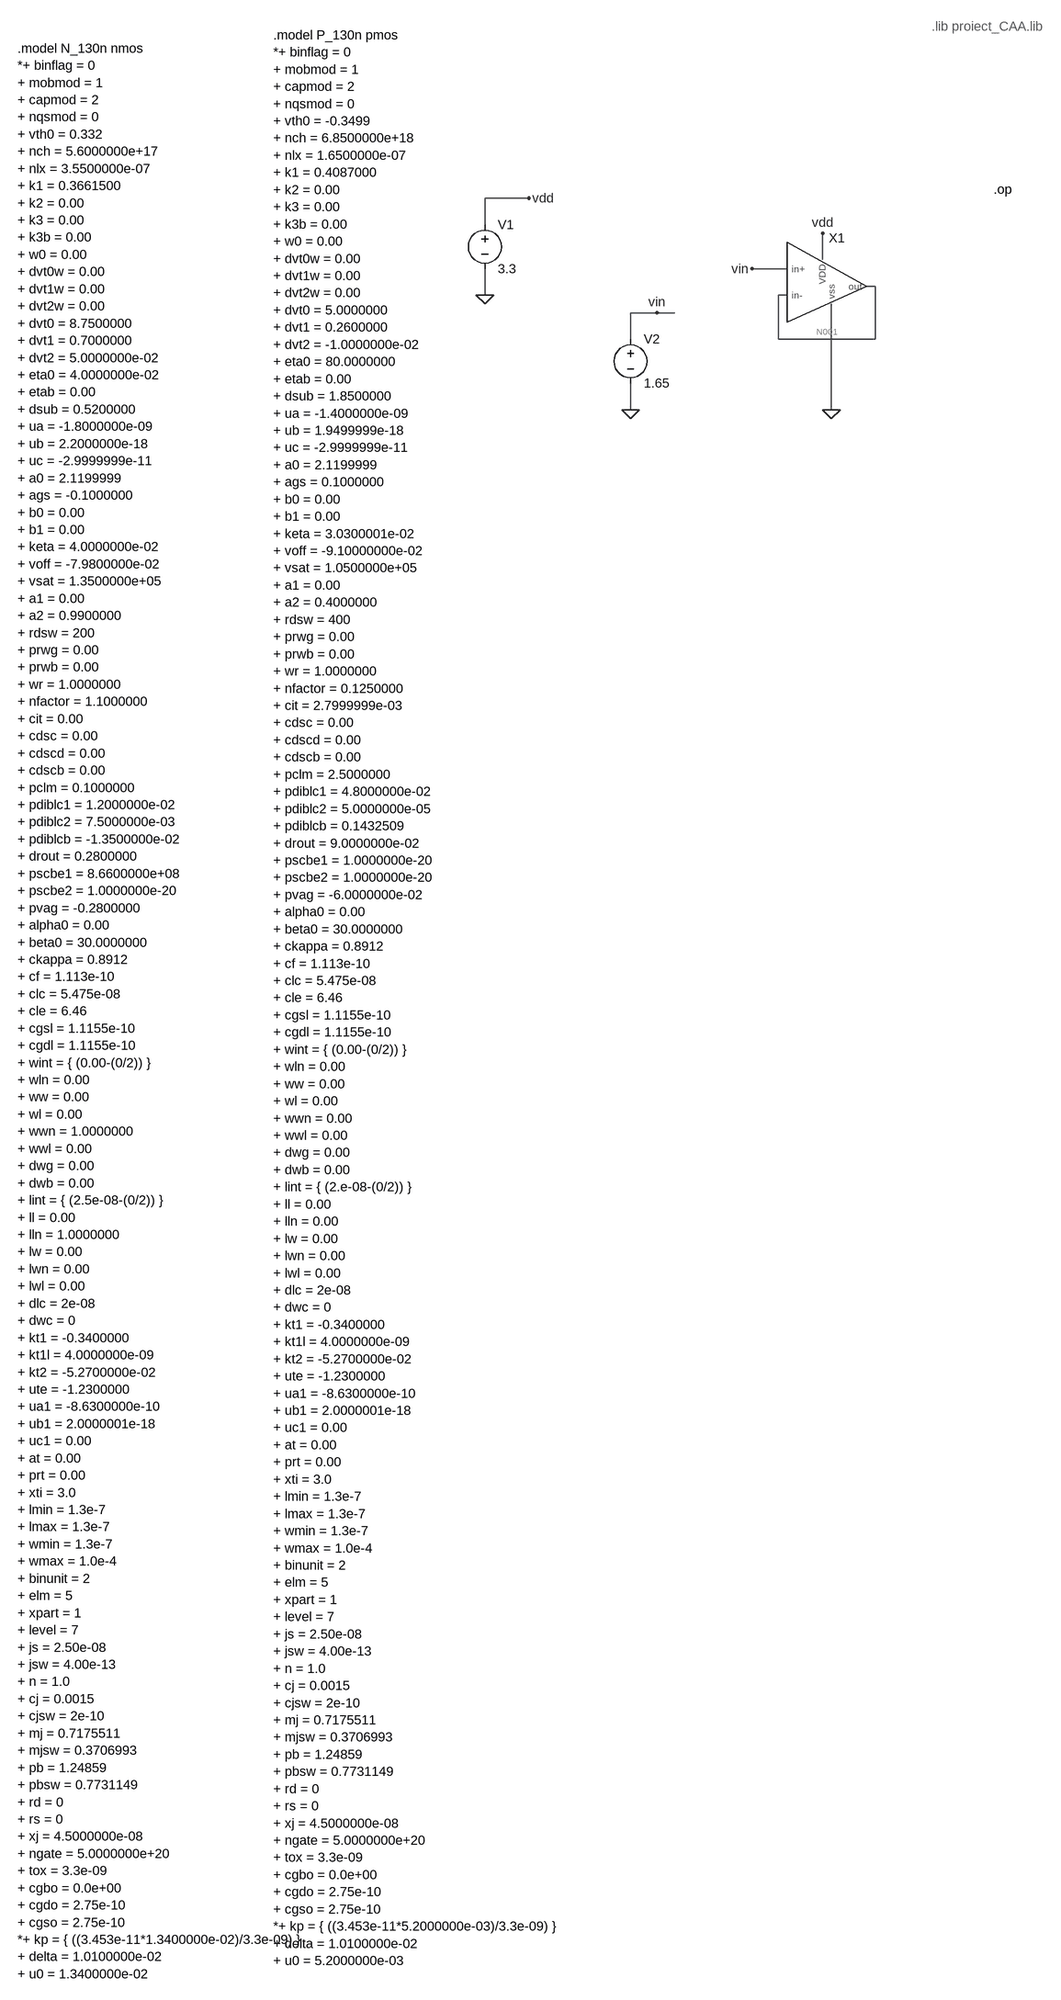
[diagram p0: schematic test_foldedCascode.asc]
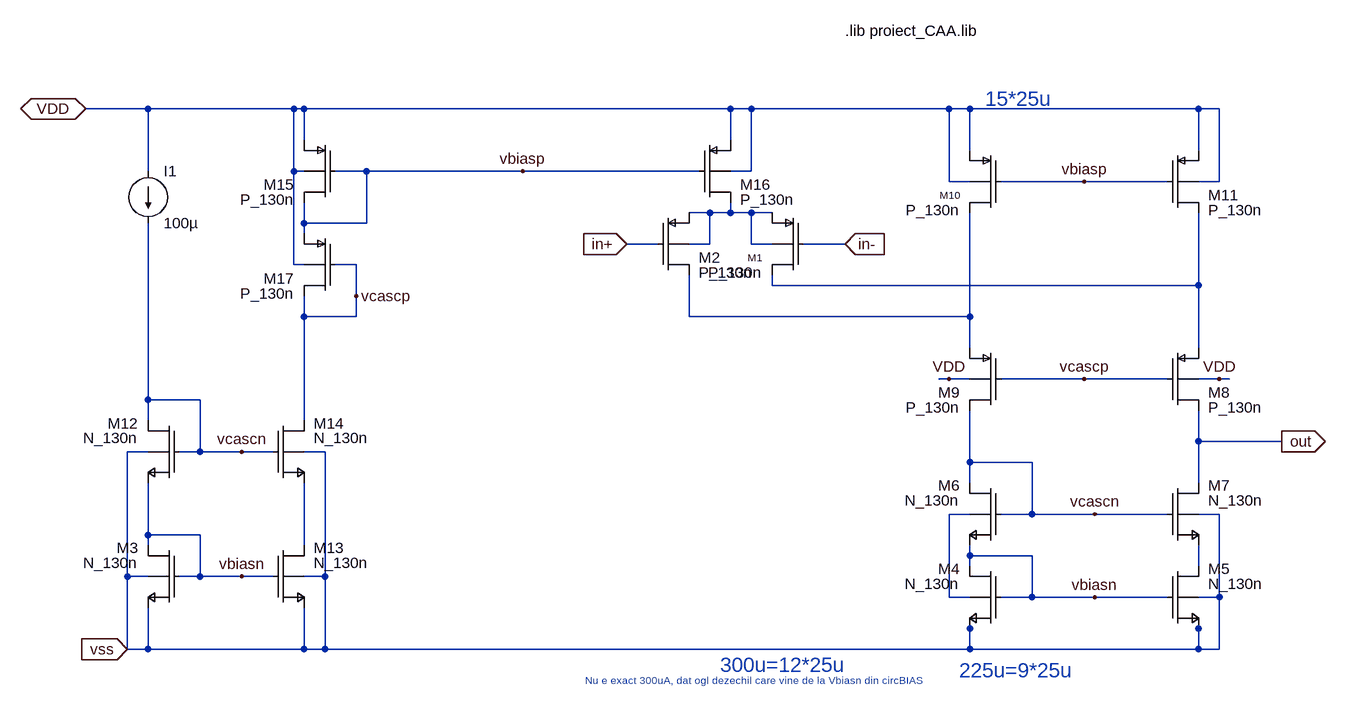
[diagram p1: sub-circuit foldedcascode.asc]
test_foldedCascode.asc, the LTspice schematic file:
Version 4
SHEET 1 1072 2848
WIRE -1792 -32 -1872 -32
WIRE -1872 16 -1872 -32
WIRE -1024 80 -1024 32
WIRE -1088 96 -1152 96
WIRE -928 128 -944 128
WIRE -1872 144 -1872 96
WIRE -1088 144 -1104 144
WIRE -1488 176 -1536 176
WIRE -1456 176 -1488 176
WIRE -1536 224 -1536 176
WIRE -1104 224 -1104 144
WIRE -928 224 -928 128
WIRE -928 224 -1104 224
WIRE -1536 352 -1536 304
WIRE -1008 352 -1008 160
FLAG -1008 352 0
FLAG -1536 352 0
FLAG -1872 144 0
FLAG -1792 -32 vdd
FLAG -1024 32 vdd
FLAG -1488 176 vin
FLAG -1152 96 vin
SYMBOL voltage -1872 0 R0
WINDOW 123 0 0 Left 0
WINDOW 39 0 0 Left 0
SYMATTR InstName V1
SYMATTR Value 3.3
SYMBOL voltage -1536 208 R0
WINDOW 123 0 0 Left 0
WINDOW 39 0 0 Left 0
SYMATTR InstName V2
SYMATTR Value 1.65
SYMBOL foldedCascode -1024 144 R0
SYMATTR InstName X1
TEXT -512 -48 Left 2 !.op
TEXT -624 -344 Left 2 ;.lib proiect_CAA.lib
TEXT -2256 -328 Left 2 !.model P_130n pmos \n*+ binflag = 0 \n+ mobmod = 1 \n+ capmod = 2 \n+ nqsmod = 0 \n+ vth0 = -0.3499 \n+ nch = 6.8500000e+18 \n+ nlx = 1.6500000e-07 \n+ k1 = 0.4087000 \n+ k2 = 0.00 \n+ k3 = 0.00 \n+ k3b = 0.00 \n+ w0 = 0.00 \n+ dvt0w = 0.00 \n+ dvt1w = 0.00 \n+ dvt2w = 0.00 \n+ dvt0 = 5.0000000 \n+ dvt1 = 0.2600000 \n+ dvt2 = -1.0000000e-02 \n+ eta0 = 80.0000000 \n+ etab = 0.00 \n+ dsub = 1.8500000 \n+ ua = -1.4000000e-09 \n+ ub = 1.9499999e-18 \n+ uc = -2.9999999e-11 \n+ a0 = 2.1199999 \n+ ags = 0.1000000 \n+ b0 = 0.00 \n+ b1 = 0.00 \n+ keta = 3.0300001e-02 \n+ voff = -9.10000000e-02 \n+ vsat = 1.0500000e+05 \n+ a1 = 0.00 \n+ a2 = 0.4000000 \n+ rdsw = 400 \n+ prwg = 0.00 \n+ prwb = 0.00 \n+ wr = 1.0000000 \n+ nfactor = 0.1250000 \n+ cit = 2.7999999e-03 \n+ cdsc = 0.00 \n+ cdscd = 0.00 \n+ cdscb = 0.00 \n+ pclm = 2.5000000 \n+ pdiblc1 = 4.8000000e-02 \n+ pdiblc2 = 5.0000000e-05 \n+ pdiblcb = 0.1432509 \n+ drout = 9.0000000e-02 \n+ pscbe1 = 1.0000000e-20 \n+ pscbe2 = 1.0000000e-20 \n+ pvag = -6.0000000e-02 \n+ alpha0 = 0.00 \n+ beta0 = 30.0000000 \n+ ckappa = 0.8912 \n+ cf = 1.113e-10 \n+ clc = 5.475e-08 \n+ cle = 6.46 \n+ cgsl = 1.1155e-10 \n+ cgdl = 1.1155e-10 \n+ wint = { (0.00-(0/2)) } \n+ wln = 0.00 \n+ ww = 0.00 \n+ wl = 0.00 \n+ wwn = 0.00 \n+ wwl = 0.00 \n+ dwg = 0.00 \n+ dwb = 0.00 \n+ lint = { (2.e-08-(0/2)) } \n+ ll = 0.00 \n+ lln = 0.00 \n+ lw = 0.00 \n+ lwn = 0.00 \n+ lwl = 0.00 \n+ dlc = 2e-08 \n+ dwc = 0 \n+ kt1 = -0.3400000 \n+ kt1l = 4.0000000e-09 \n+ kt2 = -5.2700000e-02 \n+ ute = -1.2300000 \n+ ua1 = -8.6300000e-10 \n+ ub1 = 2.0000001e-18 \n+ uc1 = 0.00 \n+ at = 0.00 \n+ prt = 0.00 \n+ xti = 3.0 \n+ lmin = 1.3e-7 \n+ lmax = 1.3e-7 \n+ wmin = 1.3e-7 \n+ wmax = 1.0e-4 \n+ binunit = 2 \n+ elm = 5 \n+ xpart = 1 \n+ level = 7 \n+ js = 2.50e-08 \n+ jsw = 4.00e-13 \n+ n = 1.0 \n+ cj = 0.0015 \n+ cjsw = 2e-10 \n+ mj = 0.7175511 \n+ mjsw = 0.3706993 \n+ pb = 1.24859 \n+ pbsw = 0.7731149 \n+ rd = 0 \n+ rs = 0 \n+ xj = 4.5000000e-08 \n+ ngate = 5.0000000e+20 \n+ tox = 3.3e-09 \n+ cgbo = 0.0e+00 \n+ cgdo = 2.75e-10 \n+ cgso = 2.75e-10 \n*+ kp = { ((3.453e-11*5.2000000e-03)/3.3e-09) } \n+ delta = 1.0100000e-02 \n+ u0 = 5.2000000e-03
TEXT -2720 -304 Left 2 !.model N_130n nmos \n*+ binflag = 0 \n+ mobmod = 1 \n+ capmod = 2 \n+ nqsmod = 0 \n+ vth0 = 0.332 \n+ nch = 5.6000000e+17 \n+ nlx = 3.5500000e-07 \n+ k1 = 0.3661500 \n+ k2 = 0.00 \n+ k3 = 0.00 \n+ k3b = 0.00 \n+ w0 = 0.00 \n+ dvt0w = 0.00 \n+ dvt1w = 0.00 \n+ dvt2w = 0.00 \n+ dvt0 = 8.7500000 \n+ dvt1 = 0.7000000 \n+ dvt2 = 5.0000000e-02 \n+ eta0 = 4.0000000e-02 \n+ etab = 0.00 \n+ dsub = 0.5200000 \n+ ua = -1.8000000e-09 \n+ ub = 2.2000000e-18 \n+ uc = -2.9999999e-11 \n+ a0 = 2.1199999 \n+ ags = -0.1000000 \n+ b0 = 0.00 \n+ b1 = 0.00 \n+ keta = 4.0000000e-02 \n+ voff = -7.9800000e-02 \n+ vsat = 1.3500000e+05 \n+ a1 = 0.00 \n+ a2 = 0.9900000 \n+ rdsw = 200 \n+ prwg = 0.00 \n+ prwb = 0.00 \n+ wr = 1.0000000 \n+ nfactor = 1.1000000 \n+ cit = 0.00 \n+ cdsc = 0.00 \n+ cdscd = 0.00 \n+ cdscb = 0.00 \n+ pclm = 0.1000000 \n+ pdiblc1 = 1.2000000e-02 \n+ pdiblc2 = 7.5000000e-03 \n+ pdiblcb = -1.3500000e-02 \n+ drout = 0.2800000 \n+ pscbe1 = 8.6600000e+08 \n+ pscbe2 = 1.0000000e-20 \n+ pvag = -0.2800000 \n+ alpha0 = 0.00 \n+ beta0 = 30.0000000 \n+ ckappa = 0.8912 \n+ cf = 1.113e-10 \n+ clc = 5.475e-08 \n+ cle = 6.46 \n+ cgsl = 1.1155e-10 \n+ cgdl = 1.1155e-10 \n+ wint = { (0.00-(0/2)) } \n+ wln = 0.00 \n+ ww = 0.00 \n+ wl = 0.00 \n+ wwn = 1.0000000 \n+ wwl = 0.00 \n+ dwg = 0.00 \n+ dwb = 0.00 \n+ lint = { (2.5e-08-(0/2)) } \n+ ll = 0.00 \n+ lln = 1.0000000 \n+ lw = 0.00 \n+ lwn = 0.00 \n+ lwl = 0.00 \n+ dlc = 2e-08 \n+ dwc = 0 \n+ kt1 = -0.3400000 \n+ kt1l = 4.0000000e-09 \n+ kt2 = -5.2700000e-02 \n+ ute = -1.2300000 \n+ ua1 = -8.6300000e-10 \n+ ub1 = 2.0000001e-18 \n+ uc1 = 0.00 \n+ at = 0.00 \n+ prt = 0.00 \n+ xti = 3.0 \n+ lmin = 1.3e-7 \n+ lmax = 1.3e-7 \n+ wmin = 1.3e-7 \n+ wmax = 1.0e-4 \n+ binunit = 2 \n+ elm = 5\n+ xpart = 1 \n+ level = 7 \n+ js = 2.50e-08 \n+ jsw = 4.00e-13 \n+ n = 1.0 \n+ cj = 0.0015 \n+ cjsw = 2e-10 \n+ mj = 0.7175511 \n+ mjsw = 0.3706993 \n+ pb = 1.24859 \n+ pbsw = 0.7731149 \n+ rd = 0 \n+ rs = 0 \n+ xj = 4.5000000e-08 \n+ ngate = 5.0000000e+20 \n+ tox = 3.3e-09 \n+ cgbo = 0.0e+00 \n+ cgdo = 2.75e-10 \n+ cgso = 2.75e-10 \n*+ kp = { ((3.453e-11*1.3400000e-02)/3.3e-09) } \n+ delta = 1.0100000e-02 \n+ u0 = 1.3400000e-02

foldedcascode.asc, the sub-circuit schematic file:
Version 4
SHEET 1 1072 700
WIRE -1696 -224 -1792 -224
WIRE -1472 -224 -1696 -224
WIRE -1456 -224 -1472 -224
WIRE -800 -224 -1456 -224
WIRE -768 -224 -800 -224
WIRE -464 -224 -768 -224
WIRE -432 -224 -464 -224
WIRE -80 -224 -432 -224
WIRE -48 -224 -80 -224
WIRE -1456 -176 -1456 -224
WIRE -800 -176 -800 -224
WIRE -432 -160 -432 -224
WIRE -80 -160 -80 -224
WIRE -1696 -128 -1696 -224
WIRE -1472 -128 -1472 -224
WIRE -1456 -128 -1472 -128
WIRE -1360 -128 -1408 -128
WIRE -1120 -128 -1360 -128
WIRE -848 -128 -1120 -128
WIRE -768 -128 -768 -224
WIRE -768 -128 -800 -128
WIRE -464 -112 -464 -224
WIRE -432 -112 -464 -112
WIRE -256 -112 -384 -112
WIRE -128 -112 -256 -112
WIRE -48 -112 -48 -224
WIRE -48 -112 -80 -112
WIRE -832 -64 -864 -64
WIRE -800 -64 -800 -80
WIRE -800 -64 -832 -64
WIRE -768 -64 -800 -64
WIRE -736 -64 -768 -64
WIRE -1456 -48 -1456 -80
WIRE -1360 -48 -1360 -128
WIRE -1360 -48 -1456 -48
WIRE -1456 -32 -1456 -48
WIRE -912 -16 -960 -16
WIRE -832 -16 -832 -64
WIRE -832 -16 -864 -16
WIRE -768 -16 -768 -64
WIRE -736 -16 -768 -16
WIRE -624 -16 -688 -16
WIRE -1472 16 -1472 -128
WIRE -1456 16 -1472 16
WIRE -1376 16 -1408 16
WIRE -736 48 -736 32
WIRE -80 48 -80 -64
WIRE -80 48 -736 48
WIRE -1376 64 -1376 16
WIRE -1456 96 -1456 64
WIRE -1376 96 -1376 64
WIRE -1376 96 -1456 96
WIRE -864 96 -864 32
WIRE -432 96 -432 -64
WIRE -432 96 -864 96
WIRE -432 144 -432 96
WIRE -80 144 -80 48
WIRE -464 192 -480 192
WIRE -432 192 -464 192
WIRE -256 192 -384 192
WIRE -128 192 -256 192
WIRE -48 192 -80 192
WIRE -32 192 -48 192
WIRE -1696 224 -1696 -48
WIRE -1616 224 -1696 224
WIRE -1696 256 -1696 224
WIRE -1456 256 -1456 96
WIRE -80 288 -80 240
WIRE 48 288 -80 288
WIRE -1696 304 -1728 304
WIRE -1616 304 -1616 224
WIRE -1616 304 -1648 304
WIRE -1552 304 -1616 304
WIRE -1504 304 -1552 304
WIRE -1424 304 -1456 304
WIRE -432 320 -432 240
WIRE -336 320 -432 320
WIRE -432 352 -432 320
WIRE -80 352 -80 288
WIRE -432 400 -464 400
WIRE -336 400 -336 320
WIRE -336 400 -384 400
WIRE -240 400 -336 400
WIRE -128 400 -240 400
WIRE -48 400 -80 400
WIRE -1696 432 -1696 352
WIRE -1616 432 -1696 432
WIRE -1696 448 -1696 432
WIRE -1456 448 -1456 352
WIRE -432 464 -432 448
WIRE -336 464 -432 464
WIRE -432 480 -432 464
WIRE -80 480 -80 448
WIRE -1728 496 -1728 304
WIRE -1696 496 -1728 496
WIRE -1616 496 -1616 432
WIRE -1616 496 -1648 496
WIRE -1552 496 -1616 496
WIRE -1504 496 -1552 496
WIRE -1424 496 -1424 304
WIRE -1424 496 -1456 496
WIRE -464 528 -464 400
WIRE -432 528 -464 528
WIRE -336 528 -336 464
WIRE -336 528 -384 528
WIRE -240 528 -336 528
WIRE -128 528 -240 528
WIRE -48 528 -48 400
WIRE -48 528 -80 528
WIRE -432 576 -432 560
WIRE -80 576 -80 560
WIRE -1728 608 -1728 496
WIRE -1696 608 -1696 544
WIRE -1696 608 -1728 608
WIRE -1456 608 -1456 544
WIRE -1456 608 -1696 608
WIRE -1424 608 -1424 496
WIRE -1424 608 -1456 608
WIRE -432 608 -432 576
WIRE -432 608 -1424 608
WIRE -80 608 -80 576
WIRE -80 608 -432 608
WIRE -48 608 -48 528
WIRE -48 608 -80 608
FLAG -1792 -224 VDD
IOPIN -1792 -224 BiDir
FLAG -464 192 VDD
FLAG -48 192 VDD
FLAG -256 -112 vbiasp
FLAG -1120 -128 vbiasp
FLAG -960 -16 in+
IOPIN -960 -16 In
FLAG -624 -16 in-
IOPIN -624 -16 In
FLAG -1552 304 vcascn
FLAG -1552 496 vbiasn
FLAG -240 400 vcascn
FLAG -240 528 vbiasn
FLAG -1376 64 vcascp
FLAG -256 192 vcascp
FLAG 48 288 out
IOPIN 48 288 Out
FLAG -1728 608 vss
IOPIN -1728 608 In
DATAFLAG -512 48 ""
DATAFLAG -464 96 ""
DATAFLAG 0 288 ""
SYMBOL nmosb -384 480 M0
WINDOW 0 63 4 Left 2
SYMATTR InstName M4
SYMATTR Value N_130n
SYMATTR Value2 l=2.0u w=4.0u ad=800.0f as=800.0f pd=8.4u ps=8.4u m=1
SYMBOL nmosb -128 480 R0
WINDOW 0 63 4 Left 2
SYMATTR InstName M5
SYMATTR Value N_130n
SYMATTR Value2 l=2.0u w=4.0u ad=800.0f as=800.0f pd=8.4u ps=8.4u m=1
SYMBOL nmosb -384 352 M0
WINDOW 0 63 4 Left 2
SYMATTR InstName M6
SYMATTR Value N_130n
SYMATTR Value2 l=2.0u w=4.0u ad=800.0f as=800.0f pd=8.4u ps=8.4u m=1
SYMBOL nmosb -128 352 R0
WINDOW 0 63 4 Left 2
SYMATTR InstName M7
SYMATTR Value N_130n
SYMATTR Value2 l=2.0u w=4.0u ad=800.0f as=800.0f pd=8.4u ps=8.4u m=1
SYMBOL pmosb -128 144 R0
WINDOW 0 63 69 Left 2
SYMATTR InstName M8
SYMATTR Value P_130n
SYMATTR Value2 l=2.0u w=4.0u ad=800.0f as=800.0f pd=8.4u ps=8.4u m=1
SYMBOL pmosb -384 144 M0
WINDOW 0 63 69 Left 2
SYMATTR InstName M9
SYMATTR Value P_130n
SYMATTR Value2 l=2.0u w=4.0u ad=800.0f as=800.0f pd=8.4u ps=8.4u m=1
SYMBOL pmosb -384 -160 M0
WINDOW 0 63 69 Left 1
SYMATTR InstName M10
SYMATTR Value P_130n
SYMATTR Value2 l=2.0u w=4.0u ad=800.0f as=800.0f pd=8.4u ps=8.4u m=1
SYMBOL pmosb -128 -160 R0
WINDOW 0 63 69 Left 2
SYMATTR InstName M11
SYMATTR Value P_130n
SYMATTR Value2 l=1u w=14u ad=2.8p as=2.8p pd=28.4u ps=28.4u m=15
SYMBOL pmosb -688 -64 M0
WINDOW 0 63 69 Left 1
SYMATTR InstName M1
SYMATTR Value P_130n
SYMATTR Value2 l=1u w=14u ad=2.8p as=2.8p pd=28.4u ps=28.4u m=15
SYMBOL pmosb -912 -64 R0
WINDOW 0 63 69 Left 2
SYMATTR InstName M2
SYMATTR Value P_130n
SYMATTR Value2 l=1u w=14u ad=2.8p as=2.8p pd=28.4u ps=28.4u m=15
SYMBOL current -1696 -128 R0
WINDOW 123 0 0 Left 0
WINDOW 39 0 0 Left 0
SYMATTR InstName I1
SYMATTR Value 100µ
SYMBOL nmosb -1648 448 M0
WINDOW 0 63 4 Left 2
SYMATTR InstName M3
SYMATTR Value N_130n
SYMATTR Value2 l=2.0u w=4.0u ad=800.0f as=800.0f pd=8.4u ps=8.4u m=1
SYMBOL nmosb -1648 256 M0
WINDOW 0 63 4 Left 2
SYMATTR InstName M12
SYMATTR Value N_130n
SYMATTR Value2 l=2.0u w=4.0u ad=800.0f as=800.0f pd=8.4u ps=8.4u m=1
SYMBOL nmosb -1504 448 R0
WINDOW 0 63 4 Left 2
SYMATTR InstName M13
SYMATTR Value N_130n
SYMATTR Value2 l=2.0u w=4.0u ad=800.0f as=800.0f pd=8.4u ps=8.4u m=1
SYMBOL nmosb -1504 256 R0
WINDOW 0 63 4 Left 2
SYMATTR InstName M14
SYMATTR Value N_130n
SYMATTR Value2 l=2.0u w=4.0u ad=800.0f as=800.0f pd=8.4u ps=8.4u m=1
SYMBOL pmosb -1408 -176 M0
WINDOW 0 63 69 Left 2
SYMATTR InstName M15
SYMATTR Value P_130n
SYMATTR Value2 l=2.0u w=4.0u ad=800.0f as=800.0f pd=8.4u ps=8.4u m=1
SYMBOL pmosb -848 -176 R0
WINDOW 0 63 69 Left 2
SYMATTR InstName M16
SYMATTR Value P_130n
SYMATTR Value2 l=2.0u w=4.0u ad=800.0f as=800.0f pd=8.4u ps=8.4u m=1
SYMBOL pmosb -1408 -32 M0
WINDOW 0 63 69 Left 2
SYMATTR InstName M17
SYMATTR Value P_130n
SYMATTR Value2 l=2.0u w=4.0u ad=800.0f as=800.0f pd=8.4u ps=8.4u m=1
TEXT -448 640 Left 3 ;225u=9*25u
TEXT -816 632 Left 3 ;300u=12*25u
TEXT -1024 656 Left 1 ;Nu e exact 300uA, dat ogl dezechil care vine de la Vbiasn din circBIAS
TEXT -408 -240 Left 3 ;15*25u
TEXT -624 -344 Left 2 !.lib proiect_CAA.lib

The netlist it stands for:
* test_foldedCascode.asc
V1 vdd 0 3.3
V2 vin 0 1.65
XX1 vin N001 0 N001 vdd foldedcascode

* block symbol definitions
.subckt foldedcascode in+ in- vss out VDD
M4 vbiasn vbiasn vss N004 N_130n l=2.0u w=4.0u ad=800.0f as=800.0f pd=8.4u ps=8.4u m=1
M5 N006 vbiasn vss vss N_130n l=2.0u w=4.0u ad=800.0f as=800.0f pd=8.4u ps=8.4u m=1
M6 vcascn vcascn vbiasn N004 N_130n l=2.0u w=4.0u ad=800.0f as=800.0f pd=8.4u ps=8.4u m=1
M7 out vcascn N006 vss N_130n l=2.0u w=4.0u ad=800.0f as=800.0f pd=8.4u ps=8.4u m=1
M8 out vcascp N002 VDD P_130n l=2.0u w=4.0u ad=800.0f as=800.0f pd=8.4u ps=8.4u m=1
M9 vcascn vcascp N003 VDD P_130n l=2.0u w=4.0u ad=800.0f as=800.0f pd=8.4u ps=8.4u m=1
M10 N003 vbiasp VDD VDD P_130n l=2.0u w=4.0u ad=800.0f as=800.0f pd=8.4u ps=8.4u m=1
M11 N002 vbiasp VDD VDD P_130n l=1u w=14u ad=2.8p as=2.8p pd=28.4u ps=28.4u m=15
M1 N002 in- N001 N001 P_130n l=1u w=14u ad=2.8p as=2.8p pd=28.4u ps=28.4u m=15
M2 N003 in+ N001 N001 P_130n l=1u w=14u ad=2.8p as=2.8p pd=28.4u ps=28.4u m=15
I1 VDD vcascn 100µ
M3 vbiasn vbiasn vss vss N_130n l=2.0u w=4.0u ad=800.0f as=800.0f pd=8.4u ps=8.4u m=1
M12 vcascn vcascn vbiasn vss N_130n l=2.0u w=4.0u ad=800.0f as=800.0f pd=8.4u ps=8.4u m=1
M13 N005 vbiasn vss vss N_130n l=2.0u w=4.0u ad=800.0f as=800.0f pd=8.4u ps=8.4u m=1
M14 vcascp vcascn N005 vss N_130n l=2.0u w=4.0u ad=800.0f as=800.0f pd=8.4u ps=8.4u m=1
M15 vbiasp vbiasp VDD VDD P_130n l=2.0u w=4.0u ad=800.0f as=800.0f pd=8.4u ps=8.4u m=1
M16 N001 vbiasp VDD VDD P_130n l=2.0u w=4.0u ad=800.0f as=800.0f pd=8.4u ps=8.4u m=1
M17 vcascp vcascp vbiasp VDD P_130n l=2.0u w=4.0u ad=800.0f as=800.0f pd=8.4u ps=8.4u m=1
* 225u=9*25u
* 300u=12*25u
* Nu e exact 300uA, dat ogl dezechil care vine de la Vbiasn din circBIAS
* 15*25u
.lib proiect_CAA.lib
.ends foldedcascode

.model NMOS NMOS
.model PMOS PMOS
.lib standard.mos
.op
* .lib proiect_CAA.lib
.model P_130n pmos
*+ binflag = 0
+ mobmod = 1
+ capmod = 2
+ nqsmod = 0
+ vth0 = -0.3499
+ nch = 6.8500000e+18
+ nlx = 1.6500000e-07
+ k1 = 0.4087000
+ k2 = 0.00
+ k3 = 0.00
+ k3b = 0.00
+ w0 = 0.00
+ dvt0w = 0.00
+ dvt1w = 0.00
+ dvt2w = 0.00
+ dvt0 = 5.0000000
+ dvt1 = 0.2600000
+ dvt2 = -1.0000000e-02
+ eta0 = 80.0000000
+ etab = 0.00
+ dsub = 1.8500000
+ ua = -1.4000000e-09
+ ub = 1.9499999e-18
+ uc = -2.9999999e-11
+ a0 = 2.1199999
+ ags = 0.1000000
+ b0 = 0.00
+ b1 = 0.00
+ keta = 3.0300001e-02
+ voff = -9.10000000e-02
+ vsat = 1.0500000e+05
+ a1 = 0.00
+ a2 = 0.4000000
+ rdsw = 400
+ prwg = 0.00
+ prwb = 0.00
+ wr = 1.0000000
+ nfactor = 0.1250000
+ cit = 2.7999999e-03
+ cdsc = 0.00
+ cdscd = 0.00
+ cdscb = 0.00
+ pclm = 2.5000000
+ pdiblc1 = 4.8000000e-02
+ pdiblc2 = 5.0000000e-05
+ pdiblcb = 0.1432509
+ drout = 9.0000000e-02
+ pscbe1 = 1.0000000e-20
+ pscbe2 = 1.0000000e-20
+ pvag = -6.0000000e-02
+ alpha0 = 0.00
+ beta0 = 30.0000000
+ ckappa = 0.8912
+ cf = 1.113e-10
+ clc = 5.475e-08
+ cle = 6.46
+ cgsl = 1.1155e-10
+ cgdl = 1.1155e-10
+ wint = { (0.00-(0/2)) }
+ wln = 0.00
+ ww = 0.00
+ wl = 0.00
+ wwn = 0.00
+ wwl = 0.00
+ dwg = 0.00
+ dwb = 0.00
+ lint = { (2.e-08-(0/2)) }
+ ll = 0.00
+ lln = 0.00
+ lw = 0.00
+ lwn = 0.00
+ lwl = 0.00
+ dlc = 2e-08
+ dwc = 0
+ kt1 = -0.3400000
+ kt1l = 4.0000000e-09
+ kt2 = -5.2700000e-02
+ ute = -1.2300000
+ ua1 = -8.6300000e-10
+ ub1 = 2.0000001e-18
+ uc1 = 0.00
+ at = 0.00
+ prt = 0.00
+ xti = 3.0
+ lmin = 1.3e-7
+ lmax = 1.3e-7
+ wmin = 1.3e-7
+ wmax = 1.0e-4
+ binunit = 2
+ elm = 5
+ xpart = 1
+ level = 7
+ js = 2.50e-08
+ jsw = 4.00e-13
+ n = 1.0
+ cj = 0.0015
+ cjsw = 2e-10
+ mj = 0.7175511
+ mjsw = 0.3706993
+ pb = 1.24859
+ pbsw = 0.7731149
+ rd = 0
+ rs = 0
+ xj = 4.5000000e-08
+ ngate = 5.0000000e+20
+ tox = 3.3e-09
+ cgbo = 0.0e+00
+ cgdo = 2.75e-10
+ cgso = 2.75e-10
*+ kp = { ((3.453e-11*5.2000000e-03)/3.3e-09) }
+ delta = 1.0100000e-02
+ u0 = 5.2000000e-03
.model N_130n nmos
*+ binflag = 0
+ mobmod = 1
+ capmod = 2
+ nqsmod = 0
+ vth0 = 0.332
+ nch = 5.6000000e+17
+ nlx = 3.5500000e-07
+ k1 = 0.3661500
+ k2 = 0.00
+ k3 = 0.00
+ k3b = 0.00
+ w0 = 0.00
+ dvt0w = 0.00
+ dvt1w = 0.00
+ dvt2w = 0.00
+ dvt0 = 8.7500000
+ dvt1 = 0.7000000
+ dvt2 = 5.0000000e-02
+ eta0 = 4.0000000e-02
+ etab = 0.00
+ dsub = 0.5200000
+ ua = -1.8000000e-09
+ ub = 2.2000000e-18
+ uc = -2.9999999e-11
+ a0 = 2.1199999
+ ags = -0.1000000
+ b0 = 0.00
+ b1 = 0.00
+ keta = 4.0000000e-02
+ voff = -7.9800000e-02
+ vsat = 1.3500000e+05
+ a1 = 0.00
+ a2 = 0.9900000
+ rdsw = 200
+ prwg = 0.00
+ prwb = 0.00
+ wr = 1.0000000
+ nfactor = 1.1000000
+ cit = 0.00
+ cdsc = 0.00
+ cdscd = 0.00
+ cdscb = 0.00
+ pclm = 0.1000000
+ pdiblc1 = 1.2000000e-02
+ pdiblc2 = 7.5000000e-03
+ pdiblcb = -1.3500000e-02
+ drout = 0.2800000
+ pscbe1 = 8.6600000e+08
+ pscbe2 = 1.0000000e-20
+ pvag = -0.2800000
+ alpha0 = 0.00
+ beta0 = 30.0000000
+ ckappa = 0.8912
+ cf = 1.113e-10
+ clc = 5.475e-08
+ cle = 6.46
+ cgsl = 1.1155e-10
+ cgdl = 1.1155e-10
+ wint = { (0.00-(0/2)) }
+ wln = 0.00
+ ww = 0.00
+ wl = 0.00
+ wwn = 1.0000000
+ wwl = 0.00
+ dwg = 0.00
+ dwb = 0.00
+ lint = { (2.5e-08-(0/2)) }
+ ll = 0.00
+ lln = 1.0000000
+ lw = 0.00
+ lwn = 0.00
+ lwl = 0.00
+ dlc = 2e-08
+ dwc = 0
+ kt1 = -0.3400000
+ kt1l = 4.0000000e-09
+ kt2 = -5.2700000e-02
+ ute = -1.2300000
+ ua1 = -8.6300000e-10
+ ub1 = 2.0000001e-18
+ uc1 = 0.00
+ at = 0.00
+ prt = 0.00
+ xti = 3.0
+ lmin = 1.3e-7
+ lmax = 1.3e-7
+ wmin = 1.3e-7
+ wmax = 1.0e-4
+ binunit = 2
+ elm = 5
+ xpart = 1
+ level = 7
+ js = 2.50e-08
+ jsw = 4.00e-13
+ n = 1.0
+ cj = 0.0015
+ cjsw = 2e-10
+ mj = 0.7175511
+ mjsw = 0.3706993
+ pb = 1.24859
+ pbsw = 0.7731149
+ rd = 0
+ rs = 0
+ xj = 4.5000000e-08
+ ngate = 5.0000000e+20
+ tox = 3.3e-09
+ cgbo = 0.0e+00
+ cgdo = 2.75e-10
+ cgso = 2.75e-10
*+ kp = { ((3.453e-11*1.3400000e-02)/3.3e-09) }
+ delta = 1.0100000e-02
+ u0 = 1.3400000e-02
.backanno
.end

* Results of the author's LTspice run, read from the files saved beside the schematic
* Operating Point:
*   V(vdd) = 3.3 V
*   V(vin) = 1.65 V
*   V(n001) = 1.53 V
*   I(V1) = -498.7 µA
*   I(V2) = 0 A
*   Ix(x1:IN+) = 0 A
*   Ix(x1:IN-) = 0 A
*   Ix(x1:VSS) = -498.7 µA
*   Ix(x1:OUT) = -10.96 pA
*   Ix(x1:VDD) = 498.7 µA
* From the log:
*   Semiconductor Device Operating Points:
*                           --- BSIM3 MOSFETS ---
*   Name:      m:x1:4      m:x1:5      m:x1:6      m:x1:7      m:x1:3
*   Model:     n_130n      n_130n      n_130n      n_130n      n_130n
*   Id:        1.74e-04    1.74e-04    1.74e-04    1.74e-04    1.00e-04
*   Vgs:       1.46e+00    1.46e+00    1.69e+00    1.67e+00    1.15e+00
*   Vds:       7.98e-01    8.20e-01    6.58e-01    7.10e-01    1.15e+00
*   Vbs:       0.00e+00    0.00e+00   -7.98e-01   -8.20e-01    0.00e+00
*   Vth:       3.62e-01    3.62e-01    4.92e-01    4.95e-01    3.62e-01
*   Vdsat:     7.69e-01    7.69e-01    8.84e-01    8.68e-01    5.71e-01
*   Gm:        2.41e-04    2.44e-04    1.49e-04    1.67e-04    2.29e-04
*   Gds:       2.03e-05    1.62e-05    1.10e-04    7.99e-05    1.51e-06
*   Gmb        4.88e-05    4.90e-05    4.27e-05    4.45e-05    3.81e-05
*   Cbd:       2.13e-15    2.12e-15    1.82e-15    1.80e-15    1.95e-15
*   Cbs:       2.88e-15    2.88e-15    2.13e-15    2.12e-15    2.88e-15
*   Cgsov:     1.99e-15    1.99e-15    1.99e-15    1.99e-15    1.99e-15
*   Cgdov:     1.99e-15    1.99e-15    1.99e-15    1.99e-15    1.95e-15
*   Cgbov:     0.00e+00    0.00e+00    0.00e+00    0.00e+00    0.00e+00
*   dQgdVgb:   6.92e-14    6.86e-14    7.67e-14    7.45e-14    6.58e-14
*   dQgdVdb:  -7.15e-15   -6.31e-15   -2.06e-14   -1.68e-14   -2.04e-15
*   dQgdVsb:  -6.09e-14   -6.11e-14   -5.51e-14   -5.64e-14   -6.16e-14
*   dQddVgb:  -9.87e-15   -8.68e-15   -2.68e-14   -2.23e-14   -2.16e-15
*   dQddVdb:   1.49e-14    1.31e-14    4.09e-14    3.31e-14    4.09e-15
*   dQddVsb:  -2.19e-15   -1.74e-15   -9.26e-15   -6.57e-15    4.86e-17
*   dQbdVgb:  -6.28e-15   -6.50e-15   -2.62e-15   -3.34e-15   -7.81e-15
*   dQbdVdb:  -4.15e-15   -3.81e-15   -7.88e-15   -6.58e-15   -1.99e-15
*   dQbdVsb:  -6.77e-15   -6.84e-15   -4.10e-15   -4.49e-15   -7.79e-15
*   Name:      m:x1:12     m:x1:13     m:x1:14     m:x1:8      m:x1:9
*   Model:     n_130n      n_130n      n_130n      p_130n      p_130n
*   Id:        1.00e-04    5.12e-05    5.12e-05   -1.74e-04   -1.74e-04
*   Vgs:       1.34e+00    1.15e+00    2.31e+00   -2.99e+00   -2.97e+00
*   Vds:       1.34e+00    1.80e-01    1.01e-01   -1.75e+00   -1.80e+00
*   Vbs:      -1.15e+00    0.00e+00   -1.80e-01    2.49e-02    4.51e-02
*   Vth:       5.39e-01    3.62e-01    3.95e-01   -3.72e-01   -3.76e-01
*   Vdsat:     6.18e-01    5.71e-01    1.31e+00   -1.92e+00   -1.90e+00
*   Gm:        2.03e-04    7.15e-05    7.11e-07    3.78e-05    4.18e-05
*   Gds:       1.39e-06    2.30e-04    4.87e-04    2.24e-05    1.73e-05
*   Gmb        3.54e-05    1.56e-05    1.06e-05    3.31e-05    3.32e-05
*   Cbd:       1.53e-15    2.64e-15    2.53e-15    1.72e-15    1.69e-15
*   Cbs:       1.95e-15    2.88e-15    2.64e-15    2.84e-15    2.81e-15
*   Cgsov:     1.99e-15    1.99e-15    1.99e-15    1.99e-15    1.99e-15
*   Cgdov:     1.95e-15    1.99e-15    1.99e-15    1.99e-15    1.99e-15
*   Cgbov:     0.00e+00    0.00e+00    0.00e+00    0.00e+00    0.00e+00
*   dQgdVgb:   6.44e-14    8.40e-14    8.38e-14    6.87e-14    6.76e-14
*   dQgdVdb:  -2.00e-15   -3.51e-14   -4.13e-14   -8.29e-15   -6.60e-15
*   dQgdVsb:  -5.98e-14   -4.85e-14   -4.24e-14   -6.16e-14   -6.21e-14
*   dQddVgb:  -2.08e-15   -4.00e-14   -4.17e-14   -1.10e-14   -8.72e-15
*   dQddVdb:   3.58e-15    7.37e-14    8.50e-14    1.70e-14    1.34e-14
*   dQddVsb:   3.97e-17   -2.51e-14   -3.42e-14   -4.77e-15   -3.31e-15
*   dQbdVgb:  -6.56e-15   -7.42e-16   -1.28e-16   -6.02e-15   -6.43e-15
*   dQbdVdb:  -1.55e-15   -1.56e-14   -1.69e-14   -4.31e-15   -3.58e-15
*   dQbdVsb:  -4.98e-15   -4.10e-15   -2.20e-15   -3.64e-15   -3.98e-15
*   Name:      m:x1:10     m:x1:11     m:x1:1      m:x1:2      m:x1:15
*   Model:     p_130n      p_130n      p_130n      p_130n      p_130n
*   Id:       -5.82e-06   -3.37e-04    1.63e-04   -1.68e-04   -5.12e-05
*   Vgs:      -1.36e+00   -1.36e+00   -1.74e+00   -1.62e+00   -1.36e+00
*   Vds:      -4.51e-02   -2.49e-02    9.66e-03   -1.05e-02   -1.36e+00
*   Vbs:       0.00e+00    0.00e+00    0.00e+00    0.00e+00    0.00e+00
*   Vth:      -3.67e-01   -3.84e-01   -3.82e-01   -3.84e-01   -3.67e-01
*   Vdsat:    -7.31e-01   -7.01e-01   -9.56e-01   -8.68e-01   -7.31e-01
*   Gm:        4.64e-06    2.65e-04    6.01e-05    8.07e-05    8.79e-05
*   Gds:       1.25e-04    1.33e-02    1.68e-02    1.59e-02    5.77e-07
*   Gmb        1.58e-06    9.19e-05    3.84e-05    4.13e-05    1.86e-05
*   Cbd:       2.81e-15    1.46e-13    1.49e-13    1.47e-13    1.86e-15
*   Cbs:       2.88e-15    1.48e-13    1.48e-13    1.48e-13    2.88e-15
*   Cgsov:     1.99e-15    1.05e-13    1.05e-13    1.05e-13    1.99e-15
*   Cgdov:     1.99e-15    1.05e-13    1.05e-13    1.05e-13    1.95e-15
*   Cgbov:     0.00e+00    0.00e+00    0.00e+00    0.00e+00    0.00e+00
*   dQgdVgb:   8.47e-14    2.29e-12    2.28e-12    2.28e-12    6.59e-14
*   dQgdVdb:  -4.08e-14   -1.12e-12   -1.13e-12   -1.13e-12   -2.03e-15
*   dQgdVsb:  -4.37e-14   -1.17e-12   -1.14e-12   -1.15e-12   -6.19e-14
*   dQddVgb:  -4.21e-14   -1.14e-12   -1.14e-12   -1.14e-12   -2.13e-15
*   dQddVdb:   8.73e-14    2.38e-12    2.43e-12    2.41e-12    3.98e-15
*   dQddVsb:  -3.45e-14   -8.90e-13   -9.33e-13   -9.21e-13    3.04e-17
*   dQbdVgb:  -2.70e-16   -6.51e-15   -4.69e-15   -5.14e-15   -8.09e-15
*   dQbdVdb:  -1.90e-14   -5.56e-13   -5.67e-13   -5.63e-13   -1.89e-15
*   dQbdVsb:  -2.87e-15   -1.57e-13   -1.46e-13   -1.54e-13   -7.68e-15
*   Name:      m:x1:16     m:x1:17
*   Model:     p_130n      p_130n
*   Id:       -4.49e-06   -5.12e-05
*   Vgs:      -1.36e+00   -1.65e+00
*   Vds:      -3.46e-02   -1.65e+00
*   Vbs:       0.00e+00    1.36e+00
*   Vth:      -3.67e-01   -5.84e-01
*   Vdsat:    -7.31e-01   -8.27e-01
*   Gm:        3.55e-06    7.33e-05
*   Gds:       1.27e-04    4.16e-07
*   Gmb        1.22e-06    1.57e-05
*   Cbd:       2.83e-15    1.43e-15
*   Cbs:       2.88e-15    1.86e-15
*   Cgsov:     1.99e-15    1.99e-15
*   Cgdov:     1.99e-15    1.95e-15
*   Cgbov:     0.00e+00    0.00e+00
*   dQgdVgb:   8.48e-14    6.42e-14
*   dQgdVdb:  -4.11e-14   -1.99e-15
*   dQgdVsb:  -4.35e-14   -5.97e-14
*   dQddVgb:  -4.22e-14   -2.05e-15
*   dQddVdb:   8.78e-14    3.47e-15
*   dQddVsb:  -3.49e-14    2.69e-17
*   dQbdVgb:  -2.61e-16   -6.66e-15
*   dQbdVdb:  -1.91e-14   -1.44e-15
*   dQbdVsb:  -2.84e-15   -4.92e-15